# EAGLE design nanino (EAGLE 6.2)
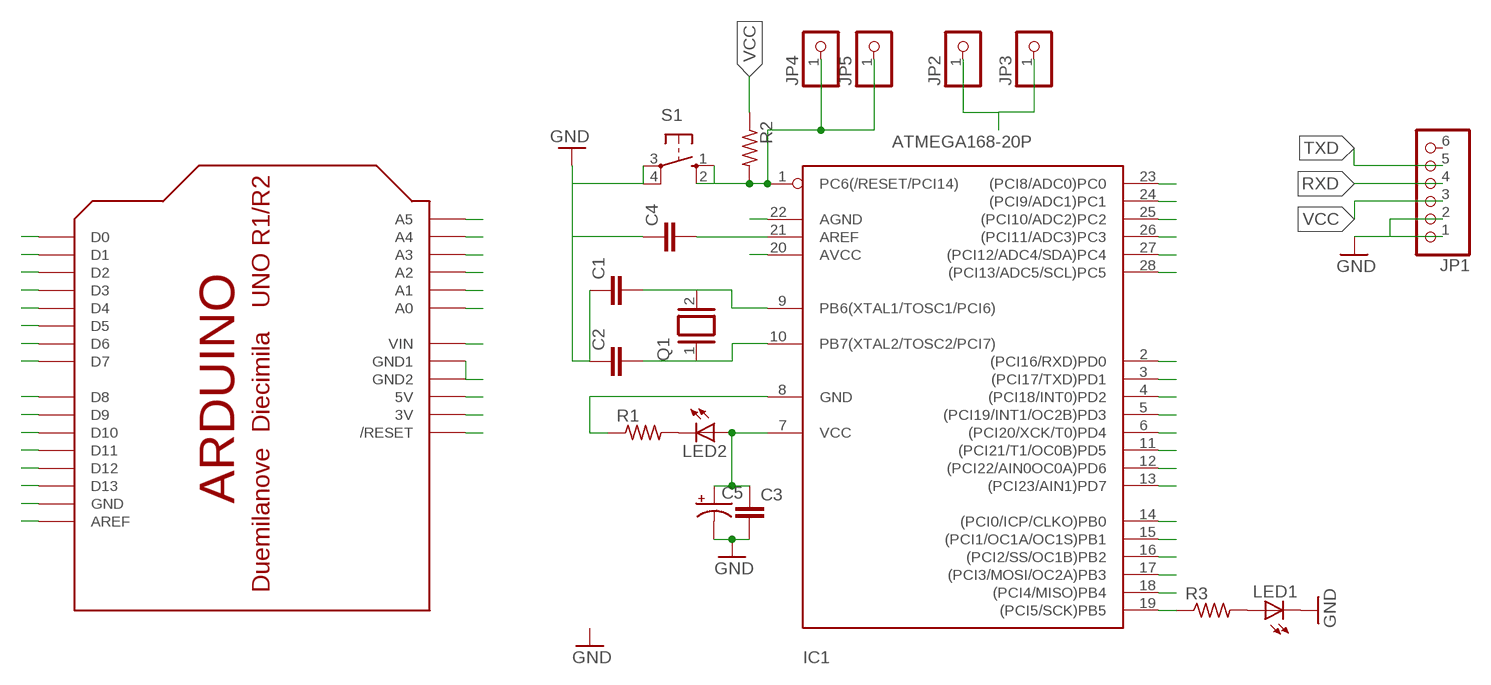
[diagram p0: schematic, sheet 1]

## Parts
C1  C-EU025-030X050  [C025-030X050]
C2  C-EU025-030X050  [C025-030X050]
C3  C-EU025-030X050  [C025-030X050]
C4  C-EU025-030X050  [C025-030X050]
C5  CPOL-USE2.5-6  [E2,5-6]
IC1  ATMEGA168-20P  [DIL28-3]
JP1  PINHD-1X6  [1X06]
JP2  PINHD-1X1CB  [1X01-CLEANBIG]
JP3  PINHD-1X1CB  [1X01-CLEANBIG]
JP4  PINHD-1X1CB  [1X01-CLEANBIG]
JP5  PINHD-1X1CB  [1X01-CLEANBIG]
LED1  LED3MM  [LED3MM]
LED2  LED3MM  [LED3MM]
Q1  XTAL/S  [QS]
R1  R-US_0207/10  [0207/10]
R2  R-US_0207/10  [0207/10]
R3  R-US_0207/10  [0207/10]
S1  10-XX  [B3F-10XX]
U$1  ARDUINOUNO  [ARDUINO]

## Nets
A0: IC1.23((PCI8/ADC0)PC0) U$1.A0
A1: IC1.24((PCI9/ADC1)PC1) U$1.A1
A2: IC1.25((PCI10/ADC2)PC2) U$1.A2
A3: IC1.26((PCI11/ADC3)PC3) U$1.A3
A4: IC1.27((PCI12/ADC4/SDA)PC4) U$1.A4
A5: IC1.28((PCI13/ADC5/SCL)PC5) U$1.A5
AREF: C4.2 IC1.21(AREF) U$1.AREF
D2: IC1.4((PCI18/INT0)PD2) U$1.D2
D3: IC1.5((PCI19/INT1/OC2B)PD3) U$1.D3
D4: IC1.6((PCI20/XCK/T0)PD4) U$1.D4
D5: IC1.11((PCI21/T1/OC0B)PD5) U$1.D5
D6: IC1.12((PCI22/AIN0OC0A)PD6) U$1.D6
D7: IC1.13((PCI23/AIN1)PD7) U$1.D7
D8: IC1.14((PCI0/ICP/CLKO)PB0) U$1.D8
D9: IC1.15((PCI1/OC1A/OC1S)PB1) U$1.D9
D10: IC1.16((PCI2/SS/OC1B)PB2) U$1.D10
D11: IC1.17((PCI3/MOSI/OC2A)PB3) U$1.D11
D12: IC1.18((PCI4/MISO)PB4) U$1.D12
D13: IC1.19((PCI5/SCK)PB5) R3.1 U$1.D13
GND: C1.1 C2.1 C3.2 C4.1 C5.- IC1.8(GND) IC1.22(AGND) JP1.1 JP1.2 LED1.K(C) R1.1 S1.3(P) S1.4(P1) U$1.GND U$1.GND1 U$1.GND2
N$1: C1.2 IC1.9(PB6(XTAL1/TOSC1/PCI6)) Q1.2
N$2: C2.2 IC1.10(PB7(XTAL2/TOSC2/PCI7)) Q1.1
N$3: LED2.K(C) R1.2
N$4: LED1.A R3.2
N$11: U$1.3V
RESET: IC1.1(PC6(/RESET/PCI14)) JP4.1 JP5.1 R2.2 S1.1(S) U$1.RESET(/RESET)
RXD: IC1.2((PCI16/RXD)PD0) JP1.4 U$1.D0
TXD: IC1.3((PCI17/TXD)PD1) JP1.5 U$1.D1
VCC: C3.1 C5.+ IC1.7(VCC) IC1.20(AVCC) JP1.3 JP2.1 JP3.1 LED2.A R2.1 U$1.5V
VIN: U$1.VIN
Unconnected: JP1.6 S1.2(S1)

## Library data of the parts
C1-C4 = rcl:C-EU: CAPACITOR, European symbol
C5 = adafruit:CPOL-US: POLARIZED CAPACITOR, American symbol
IC1 = adafruit:ATMEGA168*P: MICROCONTROLLER 16 kBytes FLASH 1 kBytes SRAM 512 Bytes EEPROM USART 8-channel 10 bit ADC
JP1 = adafruit:PINHD-1X6: PIN HEADER
JP2-JP5 = adafruit:PINHD-1X1: Pin header 1x1 for 0.1" spacing With round pins
LED1 LED2 = adafruit:LED: LED OSRAM: - CHIPLED LG R971, LG N971, LY N971, LG Q971, LY Q971, LO R971, LY R971 LH N974, LH R974 LS Q976, LO Q976, LY Q976 LO Q996 - Hyper CHIPLED LW Q18S LB Q993, LB Q99A, LB R99A - SideLED LS A670, LO A670, LY A670, LG A670, LP A670 LB A673, LV A673, LT A673, LW A673 LH A674 LY A675 LS A676, LA A676, LO A676, LY A676, LW A676 LS A679, LY A679, LG A679 - Hyper Micro SIDELED® LS Y876, LA Y876, LO Y876, LY Y876 LT Y87S - SmartLED LW L88C, LW L88S LB L89C, LB L89S, LG L890 LS L89K, LO L89K, LY L89K LS L896, LA L896, LO L896, LY L896 - TOPLED LS T670, LO T670, LY T670, LG T670, LP T670 LSG T670, LSP T670, LSY T670, LOP T670, LYG T670 LG T671, LOG T671, LSG T671 LB T673, LV T673, LT T673, LW T673 LH T674 LS T676, LA T676, LO T676, LY T676, LB T676, LH T676, LSB T676, LW T676 LB T67C, LV T67C, LT T67C, LS T67K, LO T67K, LY T67K, LW E67C LS E67B, LA E67B, LO E67B, LY E67B, LB E67C, LV E67C, LT E67C LW T67C LS T679, LY T679, LG T679 LS T770, LO T770, LY T770, LG T770, LP T770 LB T773, LV T773, LT T773, LW T773 LH T774 LS E675, LA E675, LY E675, LS T675 LS T776, LA T776, LO T776, LY T776, LB T776 LHGB T686 LT T68C, LB T68C - Hyper Mini TOPLED® LB M676 - Mini TOPLED Santana® LG M470 LS M47K, LO M47K, LY M47K Source: http://www.osram.convergy.de/
Q1 = special:XTAL/S: CRYSTAL
R1-R3 = adafruit:R-US_: RESISTOR, American symbol
S1 = switch-omron:10-XX: OMRON SWITCH; MPN: B3F-1000; OC_FARNELL: 176432; OC_NEWARK: 36M3542
U$1 = adafruit:ARDUINO: Arduino Diecimila/Duemilanove Make a shield with ease, this package has all the named pins as well as the two mounting drill holes and an outline of the USB and DC power connector. The outline is on the DIMENSION layer, so if your board house uses it they will cut the outline to match. http://www.ladyada.net/library/pcb/eaglelibrary.html

## Board
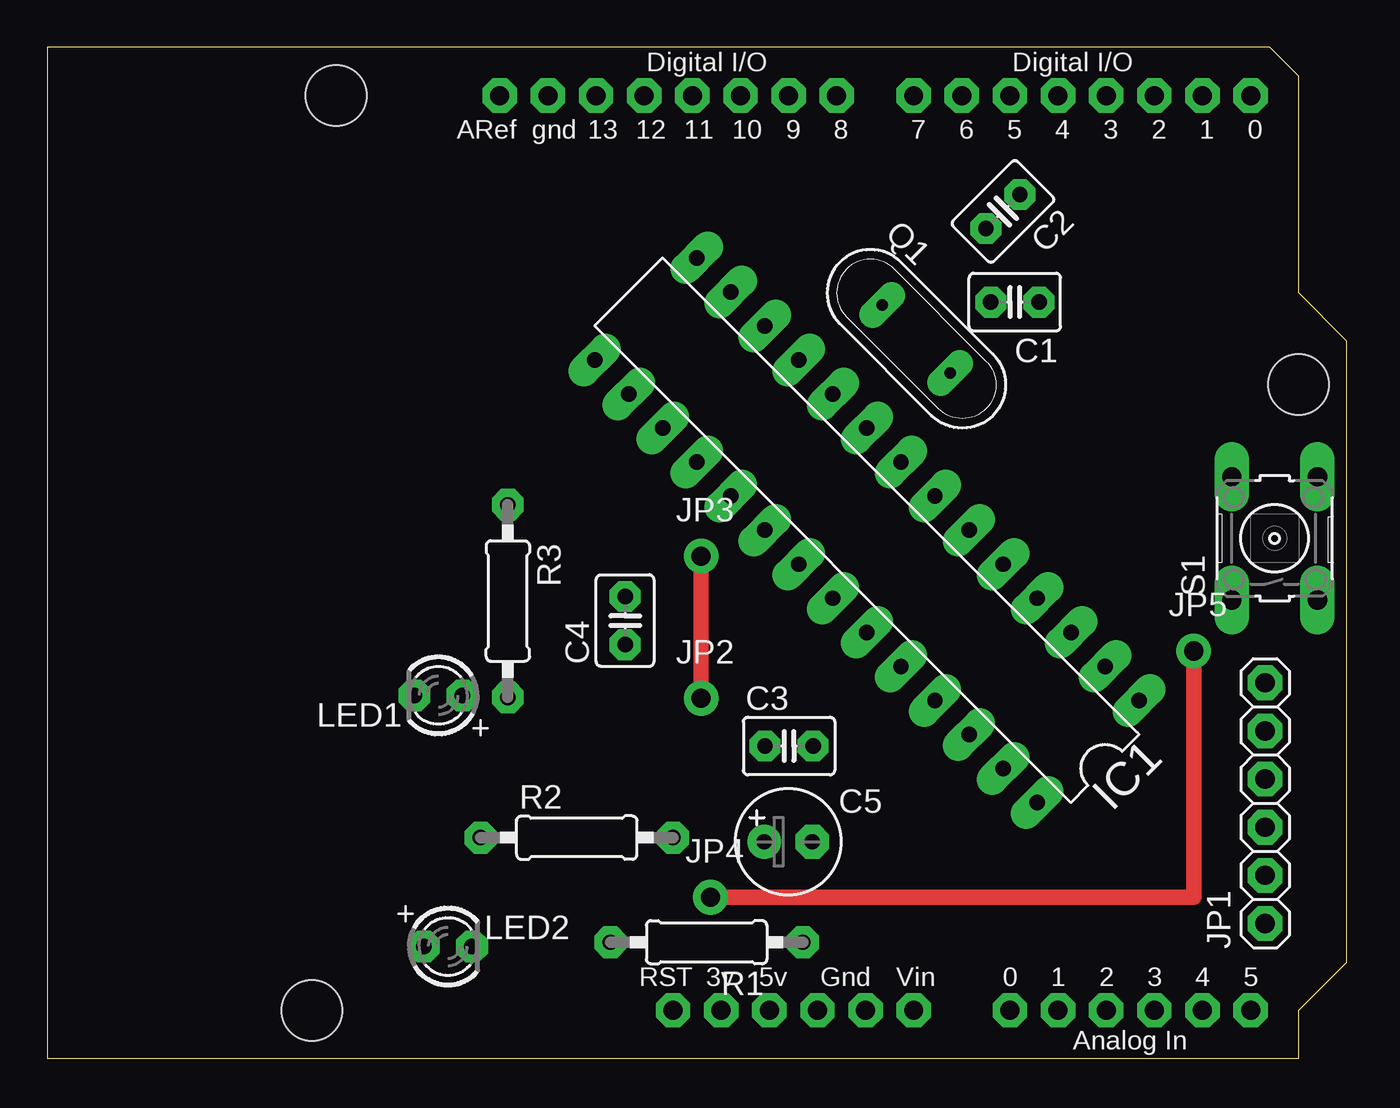
[diagram p1: board, top side]
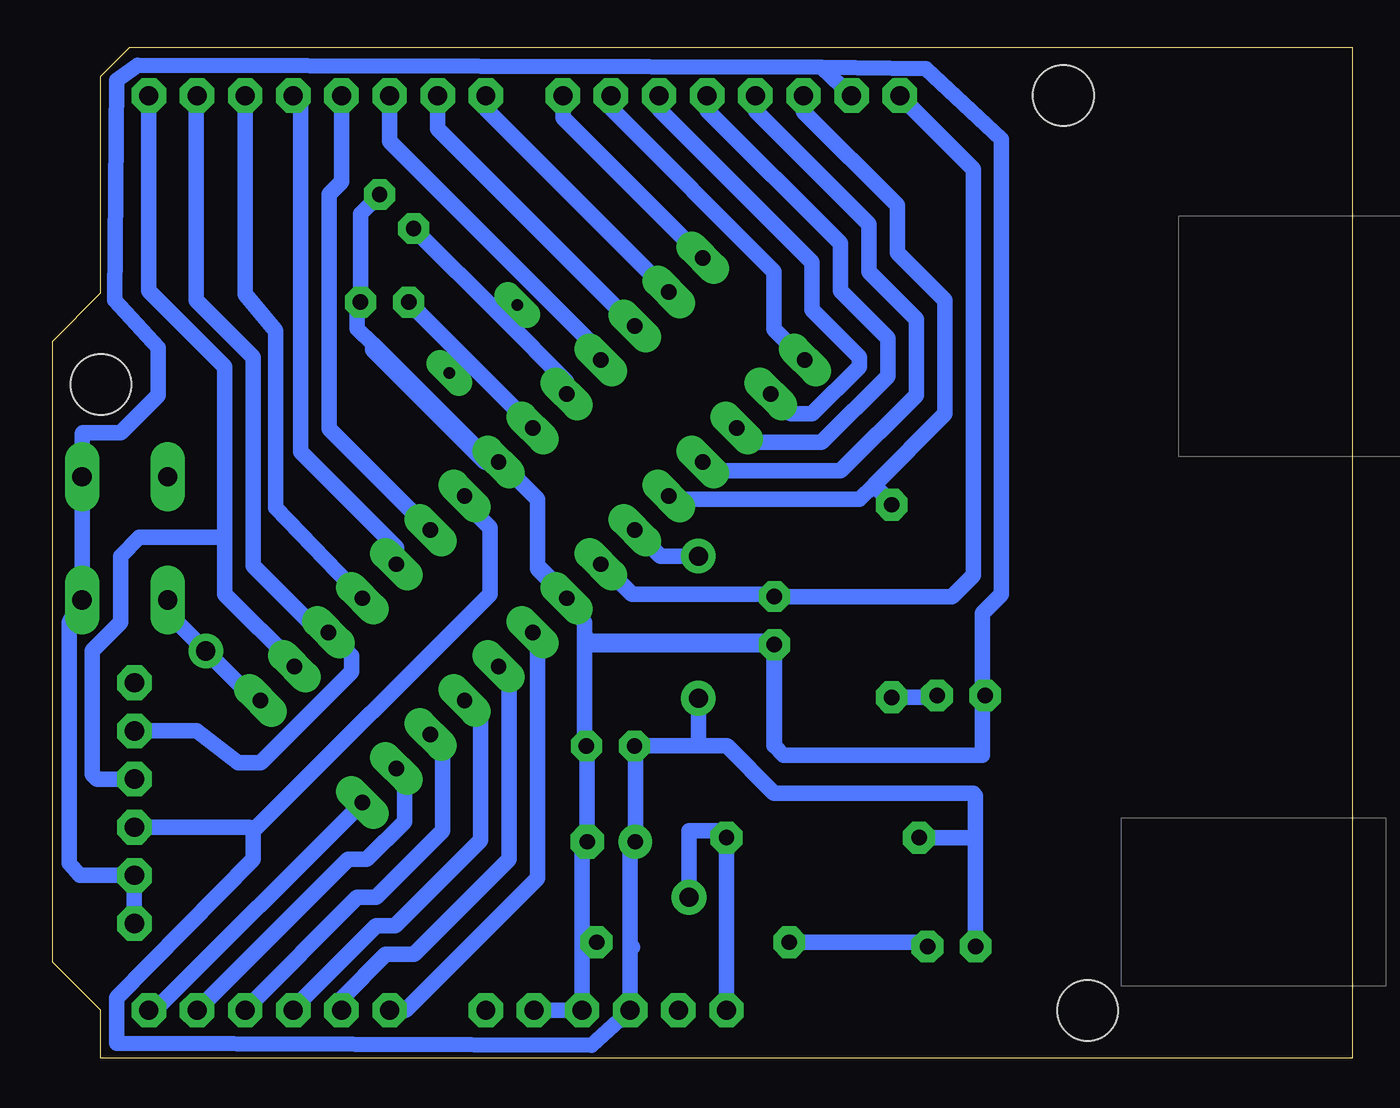
[diagram p2: board, bottom side, seen from below]

Size 68.58 x 53.34 mm. Coordinates in mm from the lower left corner, seen from the top.
Copper layers (1*16): Top 0.035mm / dielectric 1.5mm / Bottom 0.035mm
Design rules: minimum track width 10mil, minimum drill 24mil, track to track 12mil, track to pad 12mil, pad to pad 8mil, via to via 8mil, smd to smd 8mil, copper to edge 40mil, drill to drill 8mil, minimum pad ring 16mil, minimum via ring 12mil, stop-mask expansion 4mil, vias tented up to drill 0mil, thermal gap 10mil

### Footprints (pad centres in the part's own frame; a part is rotated, then mirrored left to right if it is on the bottom)
C025-030X050 = drill 0.813 octagon: 1 -1.27,0; 2 1.27,0
E2,5-6 = drill 0.813 pad 1.778: + -1.27,0 | drill 0.813 pad 1.778 octagon: - 1.27,0
DIL28-3 = drill 0.813 long: 1 -16.51,-3.81; 2 -13.97,-3.81; 3 -11.43,-3.81; 4 -8.89,-3.81; 5 -6.35,-3.81; 6 -3.81,-3.81; 7 -1.27,-3.81; 8 1.27,-3.81; 9 3.81,-3.81; 10 6.35,-3.81; 11 8.89,-3.81; 12 11.43,-3.81; 13 13.97,-3.81; 14 16.51,-3.81; 15 16.51,3.81; 16 13.97,3.81; 17 11.43,3.81; 18 8.89,3.81; 19 6.35,3.81; 20 3.81,3.81; 21 1.27,3.81; 22 -1.27,3.81; 23 -3.81,3.81; 24 -6.35,3.81; 25 -8.89,3.81; 26 -11.43,3.81; 27 -13.97,3.81; 28 -16.51,3.81
1X06 = drill 1.016 octagon: 1 -6.35,0; 2 -3.81,0; 3 -1.27,0; 4 1.27,0; 5 3.81,0; 6 6.35,0
1X01-CLEANBIG = drill 1.016 pad 1.778: 1 0,0
LED3MM = drill 0.813 pad 1.676 octagon: A -1.27,0; K 1.27,0
QS = drill 0.61 long: 1 -2.54,0; 2 2.54,0
0207/10 = drill 0.813 pad 1.676 octagon: 1 -5.08,0; 2 5.08,0
B3F-10XX = drill 1.016 long: 1 -3.251,2.261; 2 3.251,2.261; 3 -3.251,-2.261; 4 3.251,-2.261
ARDUINO = drill 1 pad 1.676 octagon: 3V 35.56,2.54; 5V 38.1,2.54; A0 50.8,2.54; A1 53.34,2.54; A2 55.88,2.54; A3 58.42,2.54; A4 60.96,2.54; A5 63.5,2.54; AREF 23.876,50.8; D0 63.5,50.8; D1 60.96,50.8; D2 58.42,50.8; D3 55.88,50.8; D4 53.34,50.8; D5 50.8,50.8; D6 48.26,50.8; D7 45.72,50.8; D8 41.656,50.8; D9 39.116,50.8; D10 36.576,50.8; D11 34.036,50.8; D12 31.496,50.8; D13 28.956,50.8; GND 26.416,50.8; GND1 43.18,2.54; GND2 40.64,2.54; RESET 33.02,2.54; VIN 45.72,2.54 | hole 3.2: 15.24,50.8; 66.04,35.56; 13.97,2.54

### Placement (x,y rotation side)
C1  51.06,39.9 180 top
C2  50.43,44.68 225 top
C3  39.14,16.48 0 top
C4  30.49,23.1 90 top
C5  39.1,11.43 0 top
IC1  43.25,27.87 135 top
JP1  64.27,13.47 90 top
JP2  34.5,19 0 top
JP3  34.5,26.5 0 top
JP4  35,8.5 0 top
JP5  60.5,21.5 0 top
LED1  20.64,19.15 180 top
LED2  21.14,5.91 0 top
Q1  45.86,37.96 315 top
R1  34.79,6.13 180 top
R2  27.94,11.65 0 top
R3  24.3,24.13 270 top
S1  64.77,27.44 90 top
U$1  0,0 0 top

### Tracks (layer width: path | path; a pad name or v marks a point on that pad's centre or on a via)
A0
  Bottom 0.813: U$1.A0 49.96,2.54 43,9.5 43,22.23 IC1.23
A1
  Bottom 0.813: U$1.A1 53.34,3.16 51,5.5 49.5,5.5 44.5,10.5 44.5,20.14 IC1.24
A2
  Bottom 0.813: U$1.A2 55.88,2.62 51.5,7 50.5,7 46,11.5 46,18.05 IC1.25
A3
  Bottom 0.813: U$1.A3 58.42,2.58 52.5,8.5 51.5,8.5 48,12 48,16.46 IC1.26
A4
  Bottom 0.813: U$1.A4 53,10.5 52,10.5 50,12.5 50,14.86 IC1.27
A5
  Bottom 0.813: U$1.A5 63.19,2.54 IC1.28
AREF
  Bottom 0.813: U$1.AREF 20,46.92 20,25.5 21.13,24.37 C4.2 30.62,24.5 38,24.5 39.57,26.07 IC1.21
D2
  Bottom 0.813: U$1.D2 58.42,40.32 56.8,38.4 56.8,29.05 IC1.4
D3
  Bottom 0.813: IC1.5 50.43,26.93 55.5,32 55.5,50.42 U$1.D3
D4
  Bottom 0.813: U$1.D4 53.34,46.26 54,45.6 54,33.23 IC1.6
D5
  Bottom 0.813: U$1.D5 50.8,48.4 39.6,37.2 39.6,36.91 IC1.11
D6
  Bottom 0.813: U$1.D6 48.26,49.04 IC1.12
D7
  Bottom 0.813: U$1.D7 45.72,50.1 IC1.13
D8
  Bottom 0.813: U$1.D8 41.66,49.62 IC1.14
D9
  Bottom 0.813: U$1.D9 39.12,50.12 30.5,41.5 30.5,38.47 IC1.15
D10
  Bottom 0.813: U$1.D10 36.58,50.08 28.5,42 28.5,39.5 26,37 26,36.5 28.5,34 29.62,34 IC1.16
D11
  Bottom 0.813: U$1.D11 34.04,50.04 27,43 27,40.5 24.5,38 24.5,36 28,32.5 31.72,32.5 IC1.17
D12
  Bottom 0.813: U$1.D12 31.5,50 25.5,44 25.5,41.5 23,39 23,35 27,31 33.81,31 IC1.18
D13
  Bottom 0.813: U$1.D13 28.96,49.96 24,45 24,42.5 21.5,40 21.5,34 25.25,30.25 | 25.25,30.25 26,29.5 35.9,29.5 IC1.19 | R3.1 24.3,29.3 25.25,30.25
GND
  Bottom 0.813: 51.7,37.7 51.7,37.4 45.76,31.46 IC1.8 44.96,31.46 44.5,31 | 51.7,37.7 52.5,38.5 52.5,39.73 C1.1 52.33,44.58 C2.1 | U$1.GND1 U$1.GND2 40.64,6 | 28.02,52.3 64.1,52.4 65.2,51.6 65.3,40 63,37.5 63,35 65,33 67,33 67.03,32.97 S1.4 S1.3 67.7,23.02 67.7,10.3 67.16,9.66 JP1.2 JP1.1 | 28.02,52.3 U$1.GND | 40.64,6 40.64,11.16 C5.- 40.37,16.44 C3.2 40.5,16.57 40.5,22 | 43,26 43,25.82 IC1.22 41.45,23.95 41,23.5 | 40.5,22.5 40.5,22 | 40.5,22.5 40.33,21.83 C4.1 30.49,16.49 | 30.49,16.49 30,16 19.5,16 19.5,19.02 | 19.5,19.02 LED1.K | R1.1 40.51,6.13 40.64,6 | 51.7,37.7 45,31 44.5,31 | 44.5,31 43,29.5 43,26 | 43,26 41,24 41,23.5 | 41,23.5 40.5,23 40.5,22.5 | 40.5,22 30.5,22 30.5,16.5 30.49,16.49 | 19.5,19.02 19.5,23.5 18.5,24.5 18.5,48.5 22.5,52.2 28.02,52.3
N$1
  Bottom 0.813: IC1.9 43.25,33.36 46.95,37.05 | 46.95,37.05 C1.2 | Q1.2 47.66,36.34 46.95,37.05
N$2
  Bottom 0.813: IC1.10 41.45,35.71 44.87,39.13 | 44.87,39.13 C2.2 | Q1.1 44.24,39.76 44.87,39.13
N$3
  Bottom 0.813: R1.2 22.13,6.13 LED2.K
N$4
  Bottom 0.813: R3.2 22.01,19.05 LED1.A
RESET
  Top 0.813: JP4.1 60.5,8.5 JP5.1
  Bottom 0.813: U$1.RESET R2.2 33.37,12 35,12 JP4.1 | IC1.1 57.89,18.89 JP5.1 62.51,23.51 S1.1
RXD
  Bottom 0.813: IC1.2 55.82,20.82 59.5,24.5 59.5,27.5 | 59.5,27.5 59.5,36.5 63.5,40.5 U$1.D0 | JP1.4 66.24,14.74 66.5,15 66.5,21.5 65,23 65,26.5 64,27.5 59.5,27.5
TXD
  Bottom 0.813: JP1.5 60.98,17.28 58.8,15.6 57.6,15.6 52.8,20.4 52.8,21.26 IC1.3 54.48,22.48 58,26 58,37 61,40 61,50.76 U$1.D1
VCC
  Top 0.813: JP2.1 JP3.1
  Bottom 0.254: IC1.7 46.99,29.21 46.84,29.34
  Bottom 0.813: 38.1,6 U$1.5V 40.14,0.7 65.2,0.8 65.2,3.2 58,10.5 58,12 | 38.1,6 38.1,11.16 C5.+ 37.83,16.44 C3.1 37.85,16.5 34.5,16.5 | 46.84,29.34 45.5,28 45.5,24.5 58,12 | JP1.3 58.2,12.2 58,12 | 37.97,5.87 38.1,6 | LED2.A 19.87,11.5 | 19.87,11.5 19.87,13.87 20,14 30.5,14 33,16.5 34.5,16.5 | R2.1 20.02,11.65 19.87,11.5 | JP2.1 34.5,16.5 | JP3.1 36.49,26.5 IC1.20